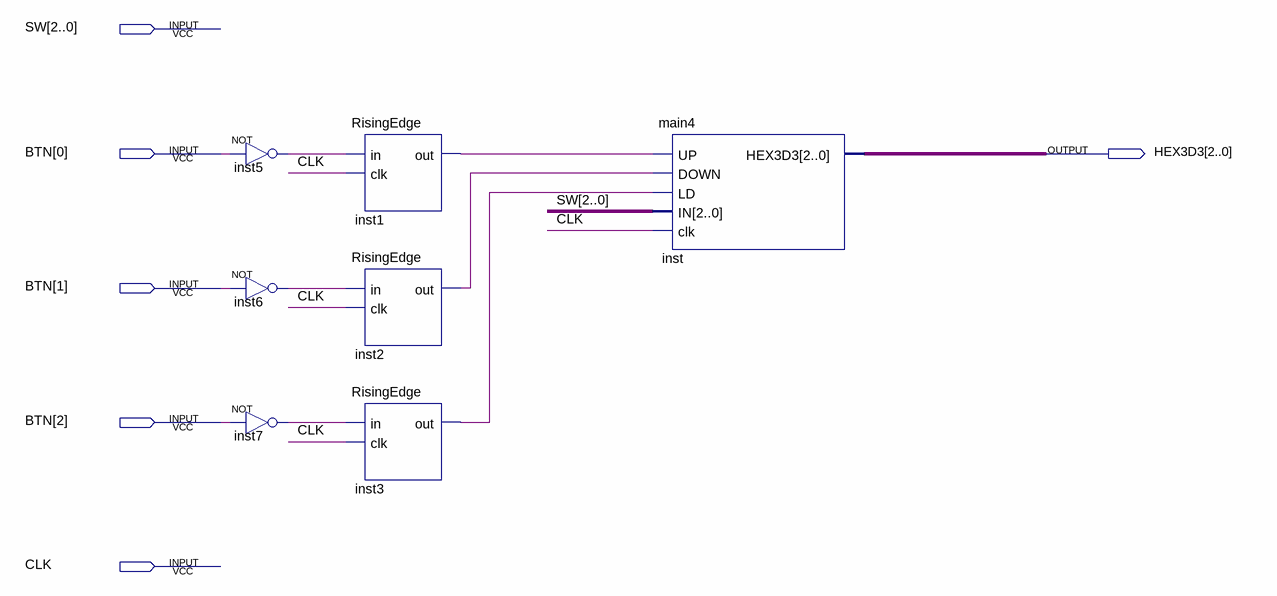
[diagram p0: schematic sheet]
// Quartus schematic test_main4.bdf as structural Verilog: 7 symbols, 6 pins
module test_main4 (
  input  [2:0] SW,
  input  [2:0] BTN,
  input  CLK,
  output [2:0] HEX3D3
);

  wire inst1_out, inst2_out, inst3_out, inst5_out, inst6_out, inst7_out;

  not inst5 (inst5_out, BTN[0]);
  not inst6 (inst6_out, BTN[1]);
  not inst7 (inst7_out, BTN[2]);
  RisingEdge inst1 (.in(inst5_out), .clk(CLK), .out(inst1_out));
  RisingEdge inst2 (.in(inst6_out), .clk(CLK), .out(inst2_out));
  RisingEdge inst3 (.in(inst7_out), .clk(CLK), .out(inst3_out));
  main4 inst (.UP(inst1_out), .DOWN(inst2_out), .LD(inst3_out), .IN(SW), .clk(CLK), .HEX3D3(HEX3D3));
endmodule
